# EAGLE design Balancer (EAGLE 7.6.0)

## Sheet 1 of 2
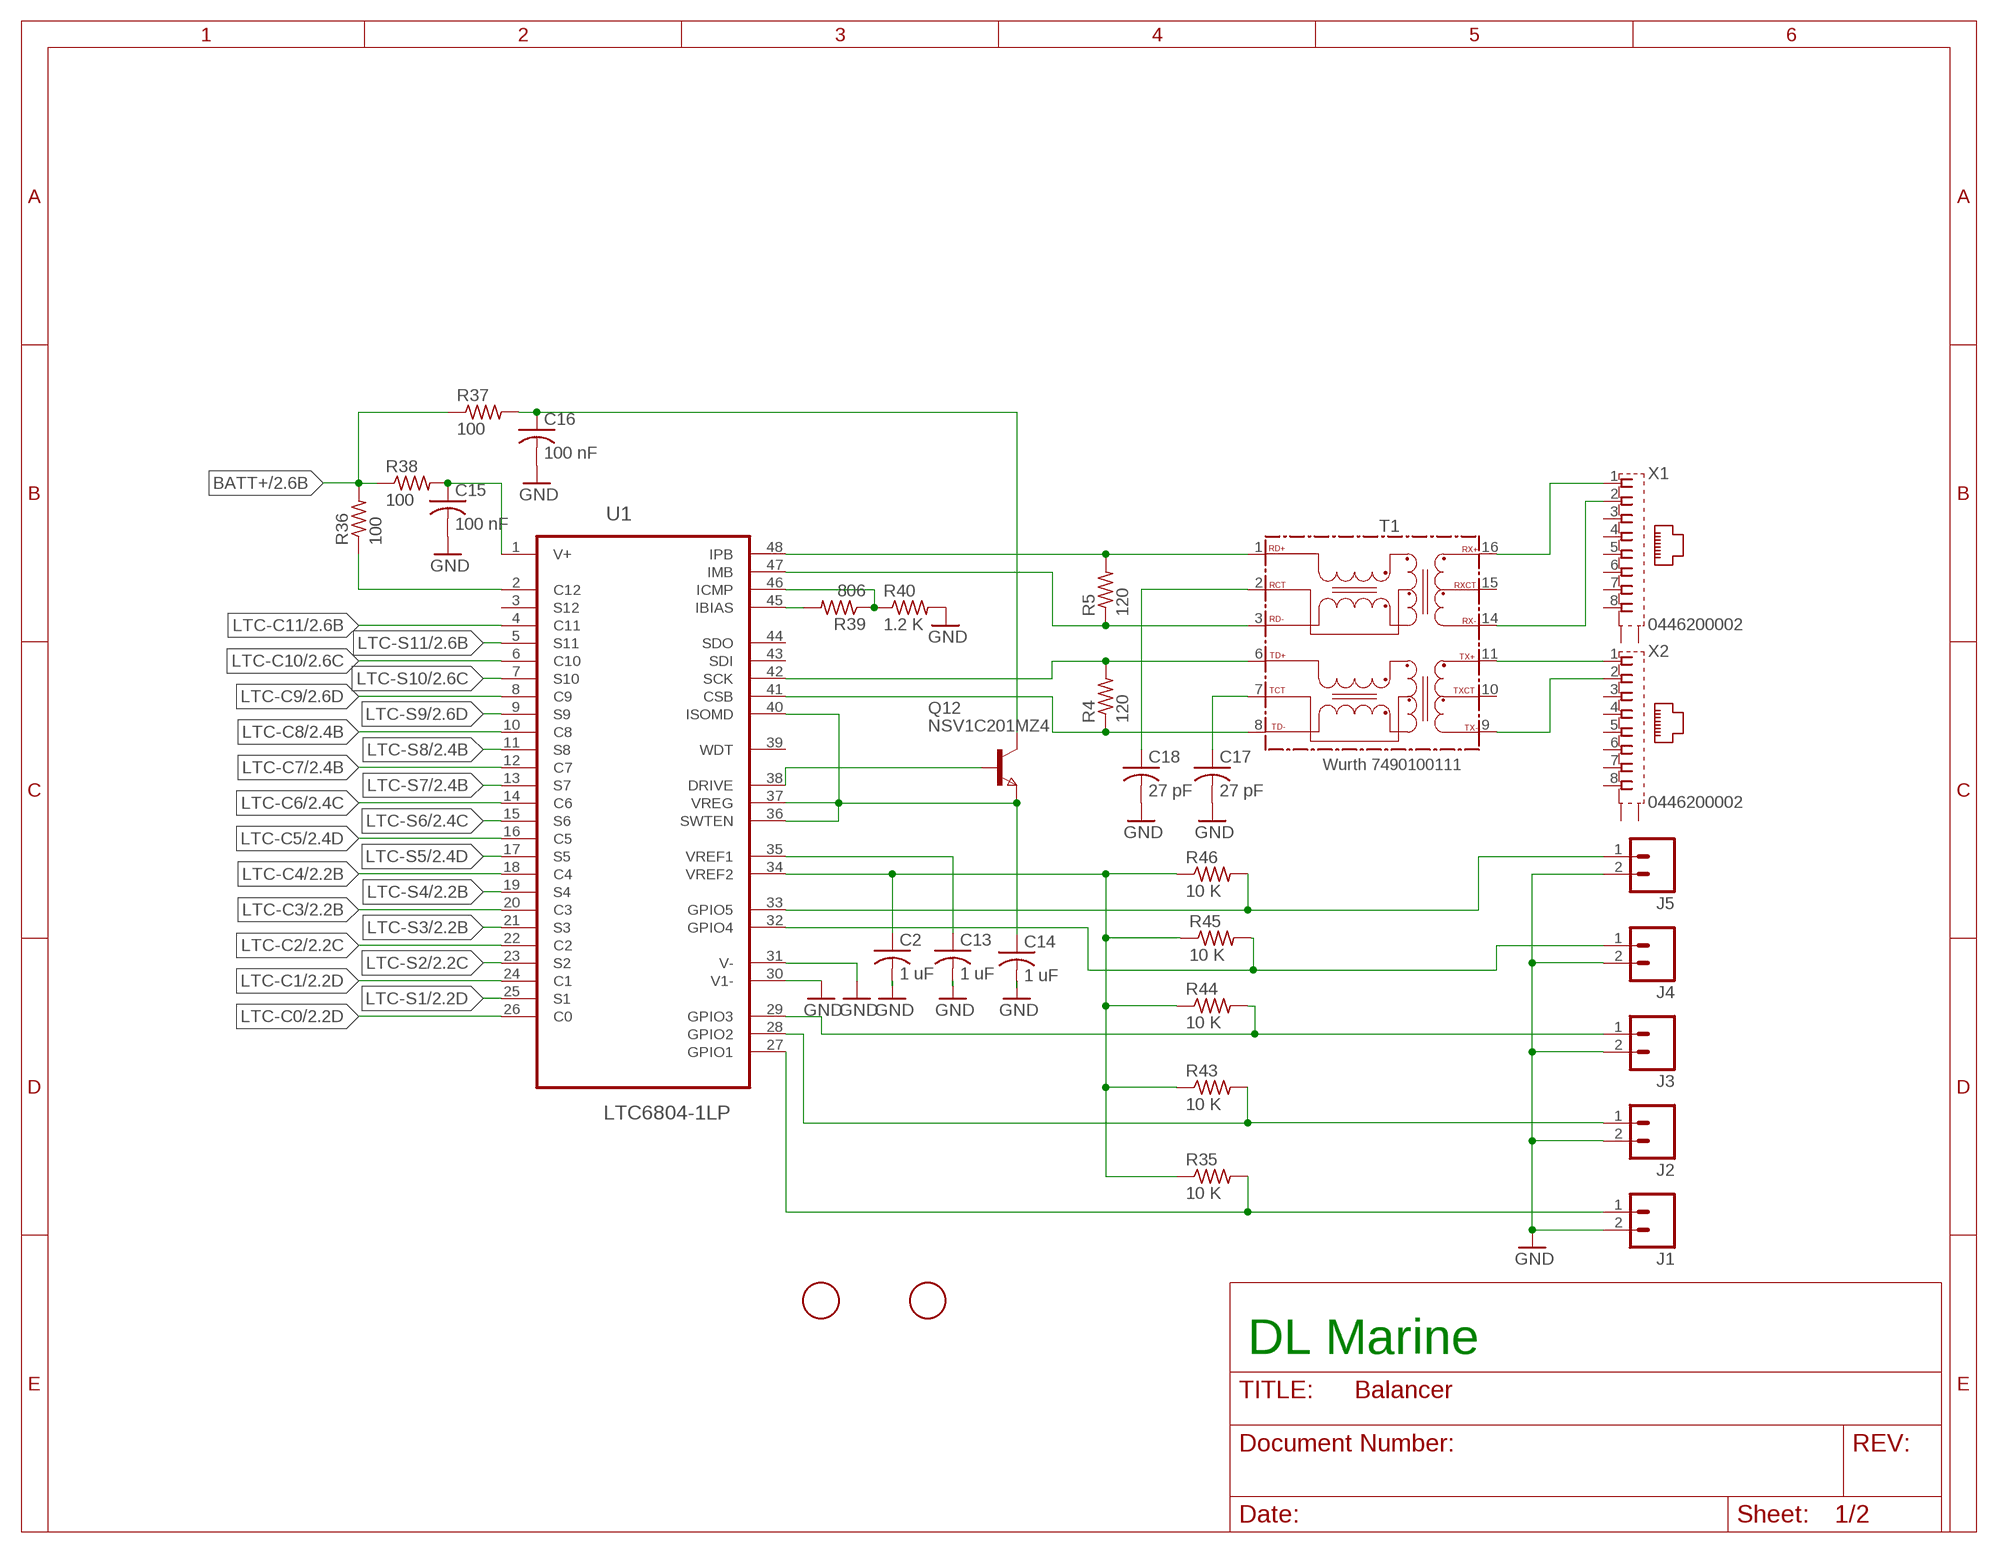
[diagram p0: schematic, sheet 1]

### Parts
C2  1 uF  C-USC0805  [C0805]
C13  1 uF  C-USC0805  [C0805]
C14  1 uF  C-USC0805  [C0805]
C15  100 nF  C-USC0805  [C0805]
C16  100 nF  C-USC0805  [C0805]
C17  27 pF  C-USC0805  [C0805]
C18  27 pF  C-USC0805  [C0805]
J1  M02PTH  [1X02]
J2  M02PTH  [1X02]
J3  M02PTH  [1X02]
J4  M02PTH  [1X02]
J5  M02PTH  [1X02]
Q12  NSV1C201MZ4  NPNSOT223  [SOT223]
R4  120  R-US_R0805  [R0805]
R5  120  R-US_R0805  [R0805]
R35  10 K  R-US_R0805  [R0805]
R36  100  R-US_R0805  [R0805]
R37  100  R-US_R0805  [R0805]
R38  100  R-US_R0805  [R0805]
R39  806  R-US_R0805  [R0805]
R40  1.2 K  R-US_R0805  [R0805]
R43  10 K  R-US_R0805  [R0805]
R44  10 K  R-US_R0805  [R0805]
R45  10 K  R-US_R0805  [R0805]
R46  10 K  R-US_R0805  [R0805]
T1  Wurth 7490100111  WE-LAN-10/100-BASE-T,749010011"  [749010011]
U1  LTC6804-1LP  [SOP50P810X110-48N]
U$1  FIDUCIAL  [FIDUCIAL_1MM]
U$2  FIDUCIAL  [FIDUCIAL_1MM]
X1  0446200002  [0446200002]
X2  0446200002  [0446200002]

### Nets
BATT+: R36.2 R37.1 R38.1 ; also sheet 2
GND: C2.2 C13.2 C14.2 C15.2 C16.2 C17.2 C18.2 J1.2 J2.2 J3.2 J4.2 J5.2 R40.2 U1.30(V1-) U1.31(V-) ; also sheet 2
LTC-C0: U1.26(C0) ; also sheet 2
LTC-C1: U1.24(C1) ; also sheet 2
LTC-C2: U1.22(C2) ; also sheet 2
LTC-C3: U1.20(C3) ; also sheet 2
LTC-C4: U1.18(C4) ; also sheet 2
LTC-C5: U1.16(C5) ; also sheet 2
LTC-C6: U1.14(C6) ; also sheet 2
LTC-C7: U1.12(C7) ; also sheet 2
LTC-C8: U1.10(C8) ; also sheet 2
LTC-C9: U1.8(C9) ; also sheet 2
LTC-C10: U1.6(C10) ; also sheet 2
LTC-C11: U1.4(C11) ; also sheet 2
LTC-S1: U1.25(S1) ; also sheet 2
LTC-S2: U1.23(S2) ; also sheet 2
LTC-S3: U1.21(S3) ; also sheet 2
LTC-S4: U1.19(S4) ; also sheet 2
LTC-S5: U1.17(S5) ; also sheet 2
LTC-S6: U1.15(S6) ; also sheet 2
LTC-S7: U1.13(S7) ; also sheet 2
LTC-S8: U1.11(S8) ; also sheet 2
LTC-S9: U1.9(S9) ; also sheet 2
LTC-S10: U1.7(S10) ; also sheet 2
LTC-S11: U1.5(S11) ; also sheet 2
N$32: C16.1 Q12.2(C) Q12.4(C) R37.2
N$34: R5.2 T1.1(RD+) U1.48(IPB)
N$35: R5.1 T1.3(RD-) U1.47(IMB)
N$36: C14.1 Q12.3(E) U1.36(SWTEN) U1.37(VREG) U1.40(ISOMD)
N$37: C13.1 U1.35(VREF1)
N$38: C2.1 R35.1 R43.1 R44.1 R45.1 R46.1 U1.34(VREF2)
N$39: R4.2 T1.6(TD+) U1.42(SCK)
N$40: R4.1 T1.8(TD-) U1.41(CSB)
N$41: R39.2 U1.45(IBIAS)
N$42: R39.1 R40.1 U1.46(ICMP)
N$43: C15.1 R38.2 U1.1(V+)
N$44: C18.1 T1.2(RCT)
N$45: C17.1 T1.7(TCT)
N$46: R36.1 U1.2(C12)
N$47: Q12.1(B) U1.38(DRIVE)
N$48: T1.16(RX+) X1.1
N$49: T1.14(RX-) X1.2
N$50: T1.11(TX+) X2.1
N$51: T1.9(TX-) X2.2
N$52: J2.1 R43.2 U1.28(GPIO2)
N$54: J1.1 R35.2 U1.27(GPIO1)
N$56: J3.1 R44.2 U1.29(GPIO3)
N$57: J4.1 R45.2 U1.32(GPIO4)
N$58: J5.1 R46.2 U1.33(GPIO5)
Unconnected: T1.10(TXCT) T1.15(RXCT) U1.3(S12) U1.39(WDT) U1.43(SDI) U1.44(SDO) X1.3 X1.4 X1.5 X1.6 X1.7 X1.8 X1.S@1(S1) X1.S@2(S2) X2.3 X2.4 X2.5 X2.6 X2.7 X2.8 X2.S@1(S1) X2.S@2(S2)

### Notes on the sheet
- DL Marine

## Sheet 2 of 2
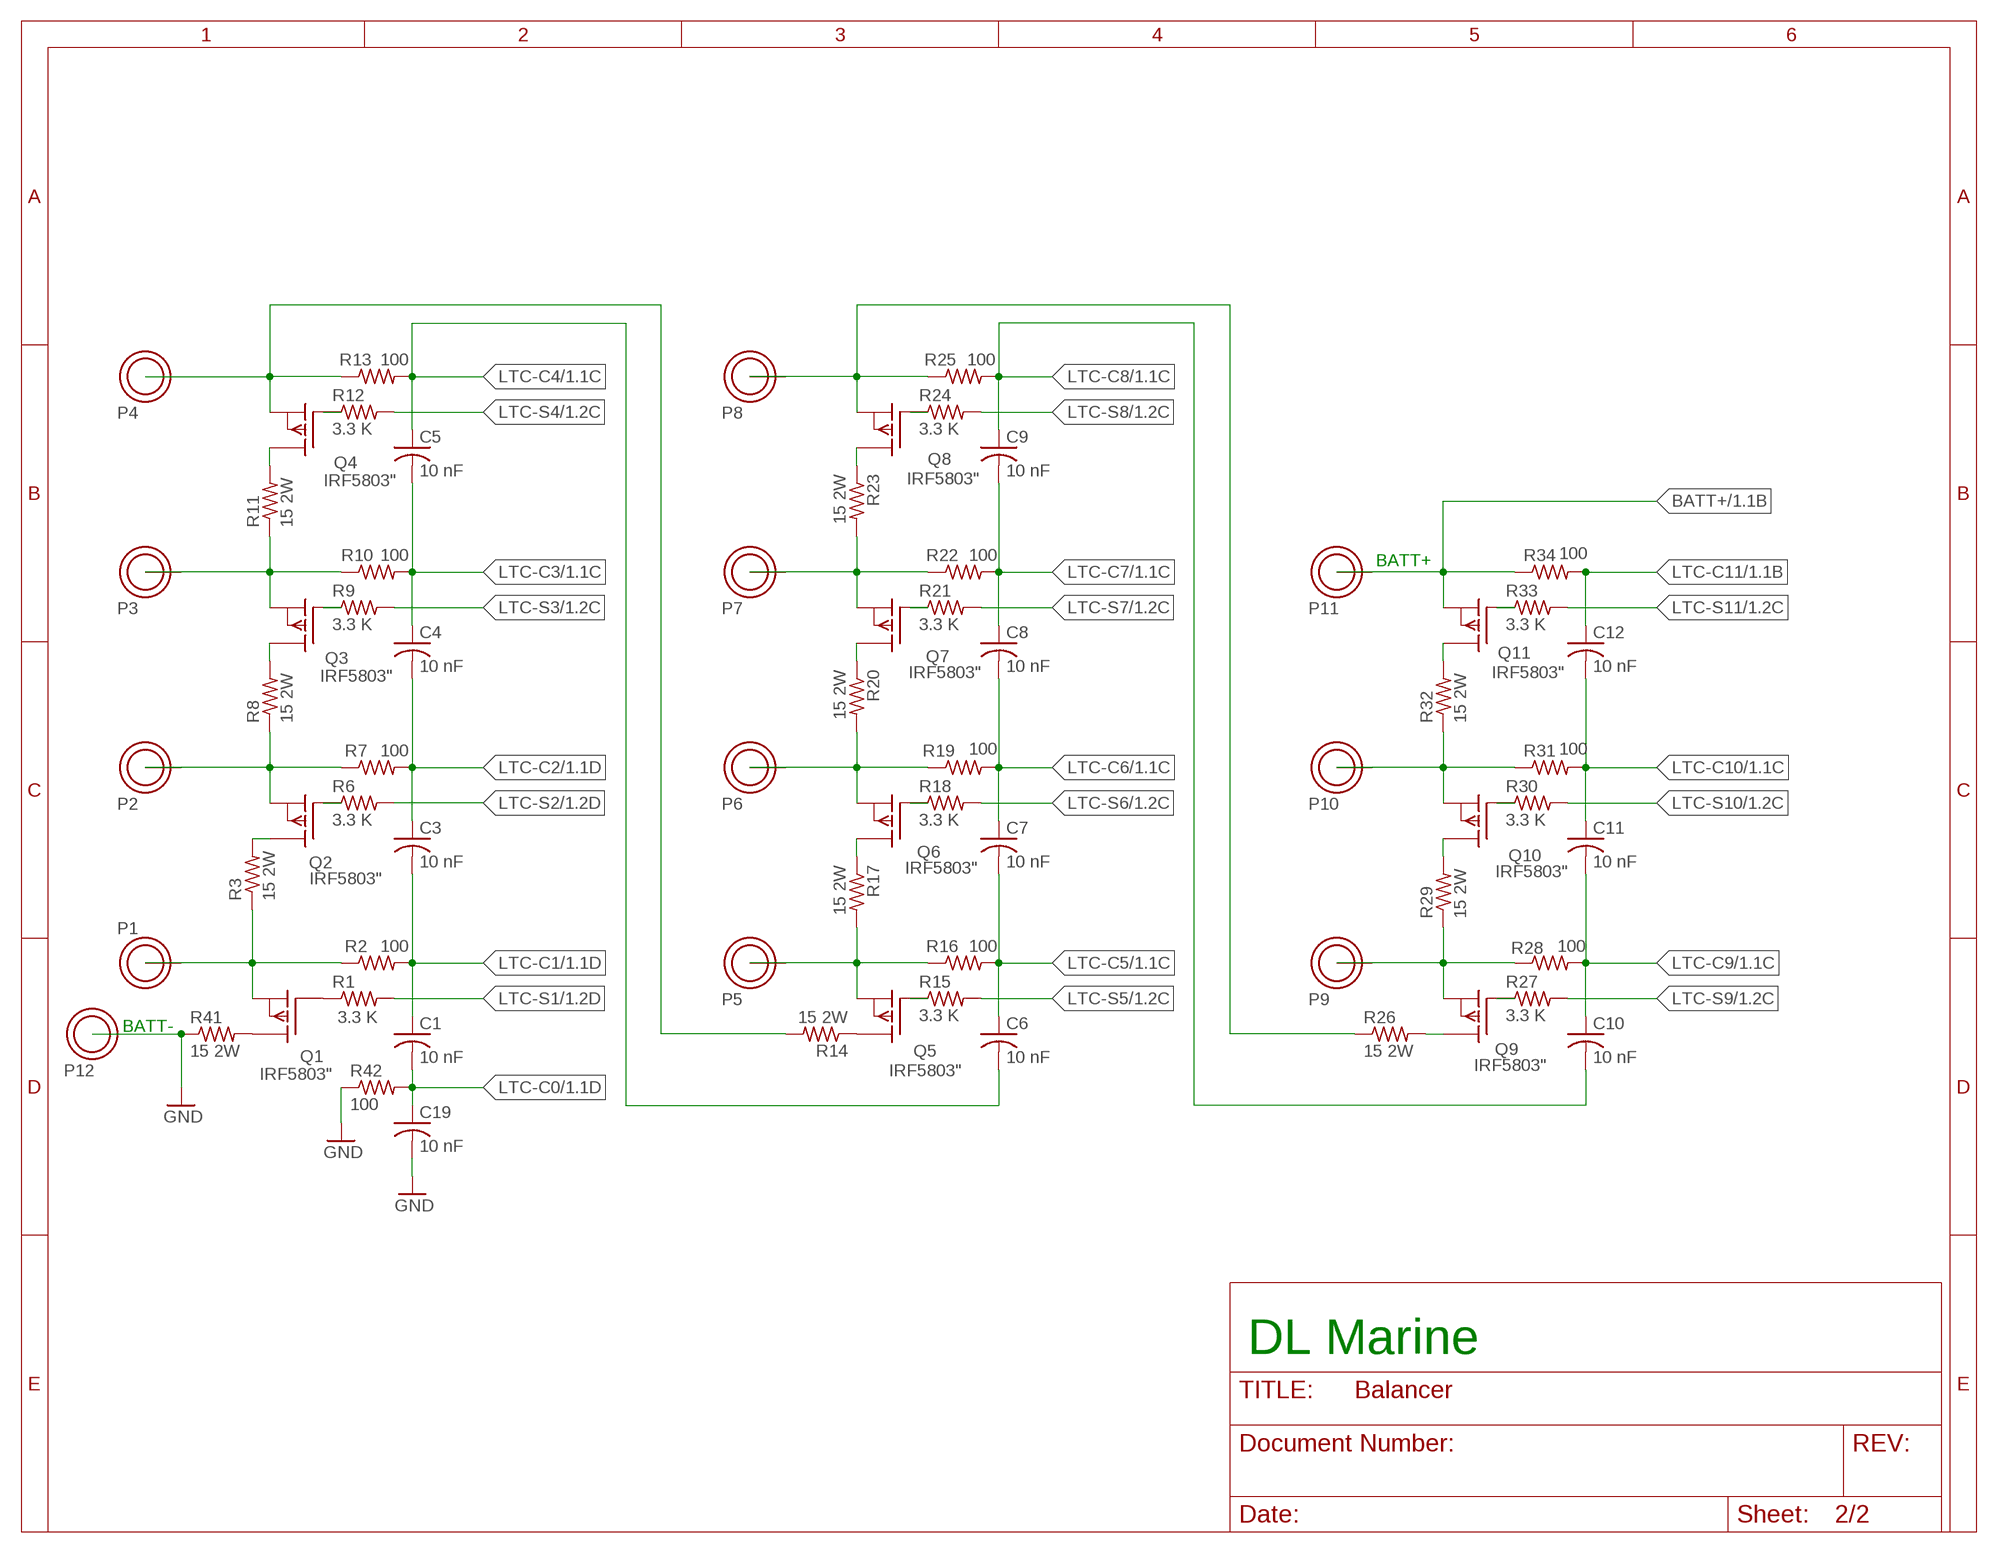
[diagram p1: schematic, sheet 2]

### Parts
C1  10 nF  C-USC0805  [C0805]
C3  10 nF  C-USC0805  [C0805]
C4  10 nF  C-USC0805  [C0805]
C5  10 nF  C-USC0805  [C0805]
C6  10 nF  C-USC0805  [C0805]
C7  10 nF  C-USC0805  [C0805]
C8  10 nF  C-USC0805  [C0805]
C9  10 nF  C-USC0805  [C0805]
C10  10 nF  C-USC0805  [C0805]
C11  10 nF  C-USC0805  [C0805]
C12  10 nF  C-USC0805  [C0805]
C19  10 nF  C-USC0805  [C0805]
P1  CONN-CELL  [CONN-CELL]
P2  CONN-CELL  [CONN-CELL]
P3  CONN-CELL  [CONN-CELL]
P4  CONN-CELL  [CONN-CELL]
P5  CONN-CELL  [CONN-CELL]
P6  CONN-CELL  [CONN-CELL]
P7  CONN-CELL  [CONN-CELL]
P8  CONN-CELL  [CONN-CELL]
P9  CONN-CELL  [CONN-CELL]
P10  CONN-CELL  [CONN-CELL]
P11  CONN-CELL  [CONN-CELL]
P12  CONN-CELL  [CONN-CELL]
Q1  IRF5803"  [TSOP6_SOT457]
Q2  IRF5803"  [TSOP6_SOT457]
Q3  IRF5803"  [TSOP6_SOT457]
Q4  IRF5803"  [TSOP6_SOT457]
Q5  IRF5803"  [TSOP6_SOT457]
Q6  IRF5803"  [TSOP6_SOT457]
Q7  IRF5803"  [TSOP6_SOT457]
Q8  IRF5803"  [TSOP6_SOT457]
Q9  IRF5803"  [TSOP6_SOT457]
Q10  IRF5803"  [TSOP6_SOT457]
Q11  IRF5803"  [TSOP6_SOT457]
R1  3.3 K  R-US_R0805  [R0805]
R2  100  R-US_R0805  [R0805]
R3  15 2W  R-US_R2512  [R2512L]
R6  3.3 K  R-US_R0805  [R0805]
R7  100  R-US_R0805  [R0805]
R8  15 2W  R-US_R2512  [R2512L]
R9  3.3 K  R-US_R0805  [R0805]
R10  100  R-US_R0805  [R0805]
R11  15 2W  R-US_R2512  [R2512L]
R12  3.3 K  R-US_R0805  [R0805]
R13  100  R-US_R0805  [R0805]
R14  15 2W  R-US_R2512  [R2512L]
R15  3.3 K  R-US_R0805  [R0805]
R16  100  R-US_R0805  [R0805]
R17  15 2W  R-US_R2512  [R2512L]
R18  3.3 K  R-US_R0805  [R0805]
R19  100  R-US_R0805  [R0805]
R20  15 2W  R-US_R2512  [R2512L]
R21  3.3 K  R-US_R0805  [R0805]
R22  100  R-US_R0805  [R0805]
R23  15 2W  R-US_R2512  [R2512L]
R24  3.3 K  R-US_R0805  [R0805]
R25  100  R-US_R0805  [R0805]
R26  15 2W  R-US_R2512  [R2512L]
R27  3.3 K  R-US_R0805  [R0805]
R28  100  R-US_R0805  [R0805]
R29  15 2W  R-US_R2512  [R2512L]
R30  3.3 K  R-US_R0805  [R0805]
R31  100  R-US_R0805  [R0805]
R32  15 2W  R-US_R2512  [R2512L]
R33  3.3 K  R-US_R0805  [R0805]
R34  100  R-US_R0805  [R0805]
R41  15 2W  R-US_R2512  [R2512L]
R42  100  R-US_R0805  [R0805]

### Nets
BATT+: P11.P$1 Q11.P$4(S) R34.1 ; also sheet 1
GND: C19.2 P12.P$1 R41.1 R42.1 ; also sheet 1
LTC-C0: C1.2 C19.1 R42.2 ; also sheet 1
LTC-C1: C1.1 C3.2 R2.2 ; also sheet 1
LTC-C2: C3.1 C4.2 R7.2 ; also sheet 1
LTC-C3: C4.1 C5.2 R10.2 ; also sheet 1
LTC-C4: C5.1 C6.2 R13.2 ; also sheet 1
LTC-C5: C6.1 C7.2 R16.2 ; also sheet 1
LTC-C6: C7.1 C8.2 R19.2 ; also sheet 1
LTC-C7: C8.1 C9.2 R22.2 ; also sheet 1
LTC-C8: C9.1 C10.2 R25.2 ; also sheet 1
LTC-C9: C10.1 C11.2 R28.2 ; also sheet 1
LTC-C10: C11.1 C12.2 R31.2 ; also sheet 1
LTC-C11: C12.1 R34.2 ; also sheet 1
LTC-S1: R1.2 ; also sheet 1
LTC-S2: R6.2 ; also sheet 1
LTC-S3: R9.2 ; also sheet 1
LTC-S4: R12.2 ; also sheet 1
LTC-S5: R15.2 ; also sheet 1
LTC-S6: R18.2 ; also sheet 1
LTC-S7: R21.2 ; also sheet 1
LTC-S8: R24.2 ; also sheet 1
LTC-S9: R27.2 ; also sheet 1
LTC-S10: R30.2 ; also sheet 1
LTC-S11: R33.2 ; also sheet 1
N$1: Q2.P$3(G) R6.1
N$2: Q1.P$3(G) R1.1
N$3: P2.P$1 Q2.P$4(S) R7.1 R8.1
N$4: P1.P$1 Q1.P$4(S) R2.1 R3.1
N$5: Q1.P$1(D) Q1.P$2(D) Q1.P$5(D) Q1.P$6(D) R41.2
N$6: Q2.P$1(D) Q2.P$2(D) Q2.P$5(D) Q2.P$6(D) R3.2
N$7: Q3.P$3(G) R9.1
N$8: P3.P$1 Q3.P$4(S) R10.1 R11.1
N$9: Q3.P$1(D) Q3.P$2(D) Q3.P$5(D) Q3.P$6(D) R8.2
N$10: Q4.P$3(G) R12.1
N$11: P4.P$1 Q4.P$4(S) R13.1 R14.2
N$12: Q4.P$1(D) Q4.P$2(D) Q4.P$5(D) Q4.P$6(D) R11.2
N$13: Q5.P$3(G) R15.1
N$14: P5.P$1 Q5.P$4(S) R16.1 R17.2
N$15: Q5.P$1(D) Q5.P$2(D) Q5.P$5(D) Q5.P$6(D) R14.1
N$16: Q6.P$3(G) R18.1
N$17: P6.P$1 Q6.P$4(S) R19.1 R20.2
N$18: Q6.P$1(D) Q6.P$2(D) Q6.P$5(D) Q6.P$6(D) R17.1
N$19: Q7.P$3(G) R21.1
N$20: P7.P$1 Q7.P$4(S) R22.1 R23.2
N$21: Q7.P$1(D) Q7.P$2(D) Q7.P$5(D) Q7.P$6(D) R20.1
N$22: Q8.P$3(G) R24.1
N$23: P8.P$1 Q8.P$4(S) R25.1 R26.1
N$24: Q8.P$1(D) Q8.P$2(D) Q8.P$5(D) Q8.P$6(D) R23.1
N$25: Q9.P$3(G) R27.1
N$26: P9.P$1 Q9.P$4(S) R28.1 R29.1
N$27: Q9.P$1(D) Q9.P$2(D) Q9.P$5(D) Q9.P$6(D) R26.2
N$28: Q10.P$3(G) R30.1
N$29: P10.P$1 Q10.P$4(S) R31.1 R32.1
N$30: Q10.P$1(D) Q10.P$2(D) Q10.P$5(D) Q10.P$6(D) R29.2
N$31: Q11.P$3(G) R33.1
N$33: Q11.P$1(D) Q11.P$2(D) Q11.P$5(D) Q11.P$6(D) R32.2

### Notes on the sheet
- BATT+
- BATT-
- DL Marine

## Library data of the parts
C1-C19 = resistor:C-US: CAPACITOR, American symbol
J1-J5 = SparkFun-Connectors:M02: Standard 2-pin 0.1" header. Use with - straight break away headers ( PRT-00116) - right angle break away headers (PRT-00553) - swiss pins (PRT-00743) - machine pins (PRT-00117) - female headers (PRT-00115) Molex polarized connector foot print use with: PRT-08233 with associated crimp pins and housings. 2.54_SCREWTERM for use with PRT-10571. 3.5mm Screw Terminal footprints for PRT-08084 5mm Screw Terminal footprints for use with PRT-08432
P1-P12 = BMS:CONN-CELL: 2.2 MM DRILL PAD FOR BATTERY CONNECTOR PIN
Q1-Q11 = BMS1:IRF5803: P-Channel Enhancement MOSFET
Q12 = zetex:NPNSOT223: NPN TRANSISTOR; MPN: DJT4031N-13; OC_FARNELL: 1710672; OC_NEWARK: 25R4490
R1 R2 R4-R7 R9 R10 R12 R13 R15 R16 R18 R19 R21 R22 R24 R25 R27 R28 R30 R31 R33-R40 R42-R46 = resistor:R-US_: RESISTOR, American symbol
R3 R8 R11 R14 R17 R20 R23 R26 R29 R32 R41 = BMS1:R-US_: RESISTOR, American symbol
T1 = WE-LAN-10_100-BASE-T,749010011:WE-LAN-10/100-BASE-T,749010011: LAN-Transformer WE-LAN 10/100 Base T - Compliant with IEEE 802.3 standards - SMD -- Ethernet -- Power over Ethernet -- 1 Gigabit Ethernet -- Compliant with most IC's for ethernet applications like Intel, AMD, Globespan and Realtek -- Hub, Router, Switch; MPN: 749010011; OC_FARNELL: 1636344; OC_NEWARK: unknown; PACKAGE: 10/100/Base-T; SUPPLIER: Wuerth Elektronik
U1 = LTC_By_element14_Batch_1:LTC6804-1LP: Multicell Battery Stack Monitor
U$1 U$2 = adafruit:FIDUCIAL: For use by pick and place machines to calibrate the vision/machine, 1mm By microbuilder.eu
X1 X2 = con-molex:0446200002: RJ-45 INVERTED MODULAR JACK ASSEMBLY WITH RJ-11 KEEPOUT FEATURE Source: Data sheet <http://www.farnell.com/datasheets/73207.pdf> MOLEX 0446200002 BUCHSE, RJ45, GESCHIRMT Source: Farnell <http://de.farnell.com/molex/0446200002/buchse-rj45-geschirmt/dp/9251910?ost=9251910>; MF: MOLEX; MPN: 0446200002; OC_FARNELL: 9251910

## Board
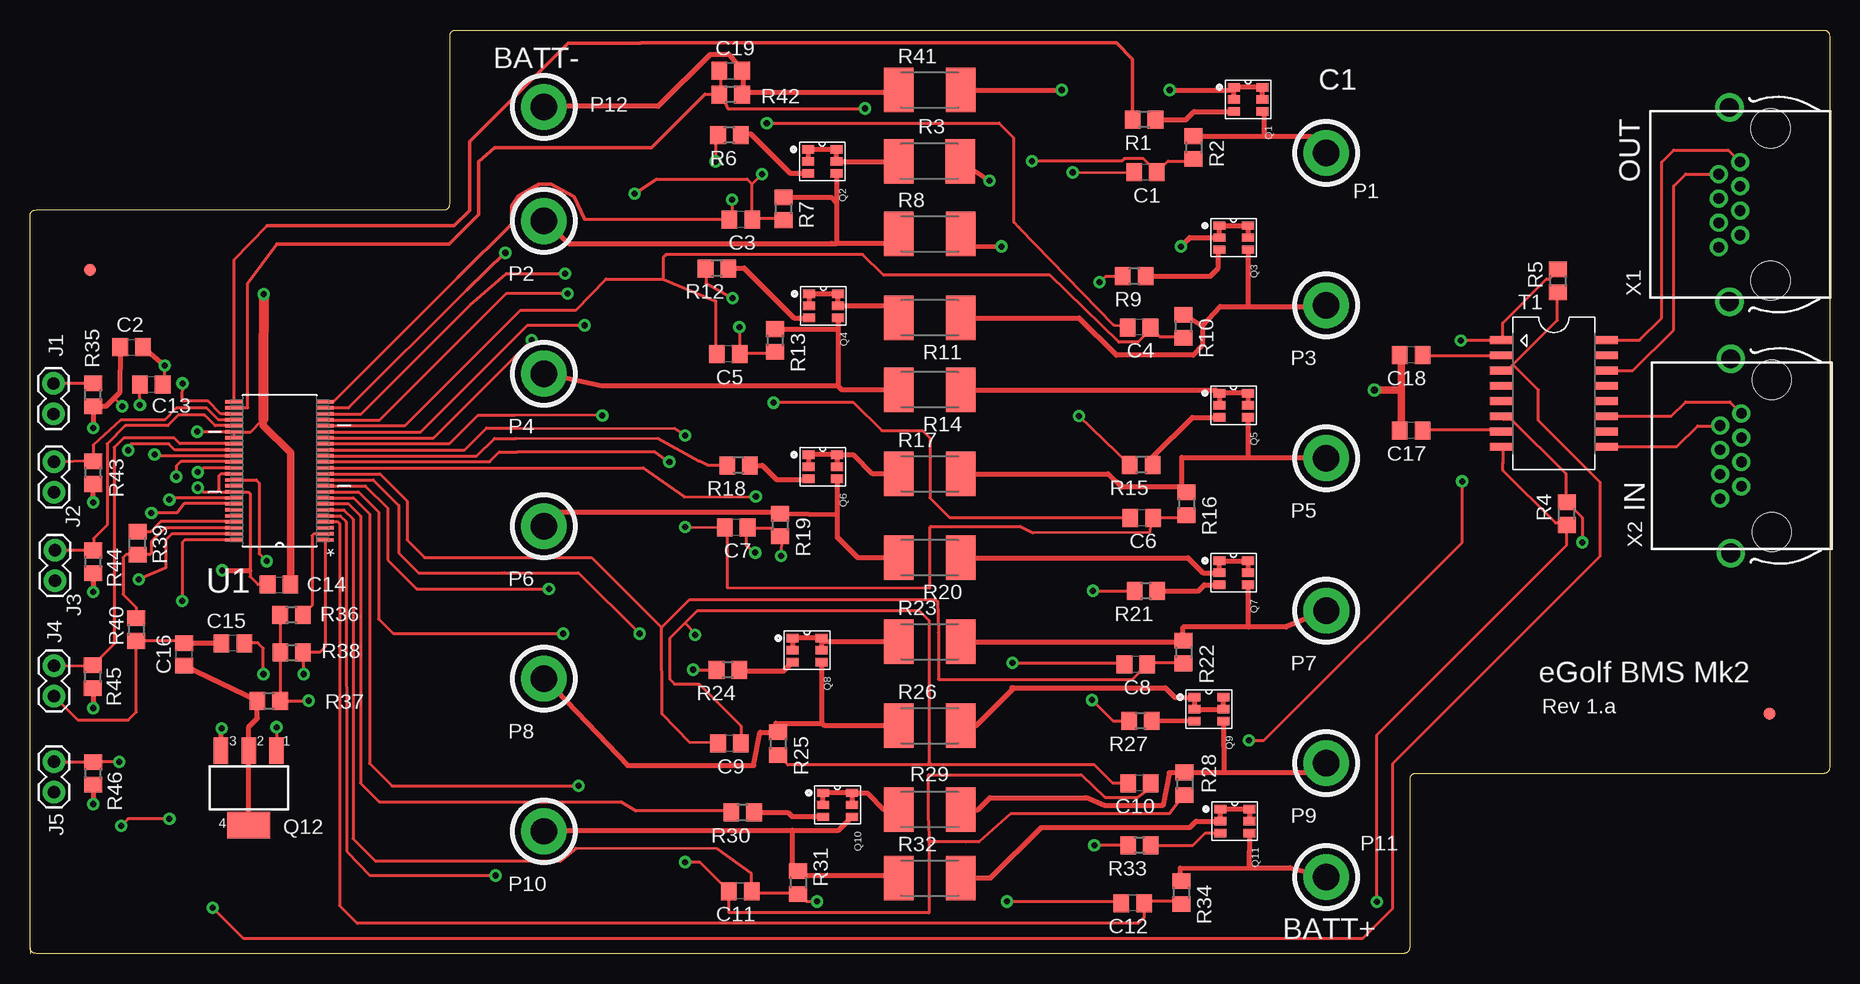
[diagram p2: board, top side]
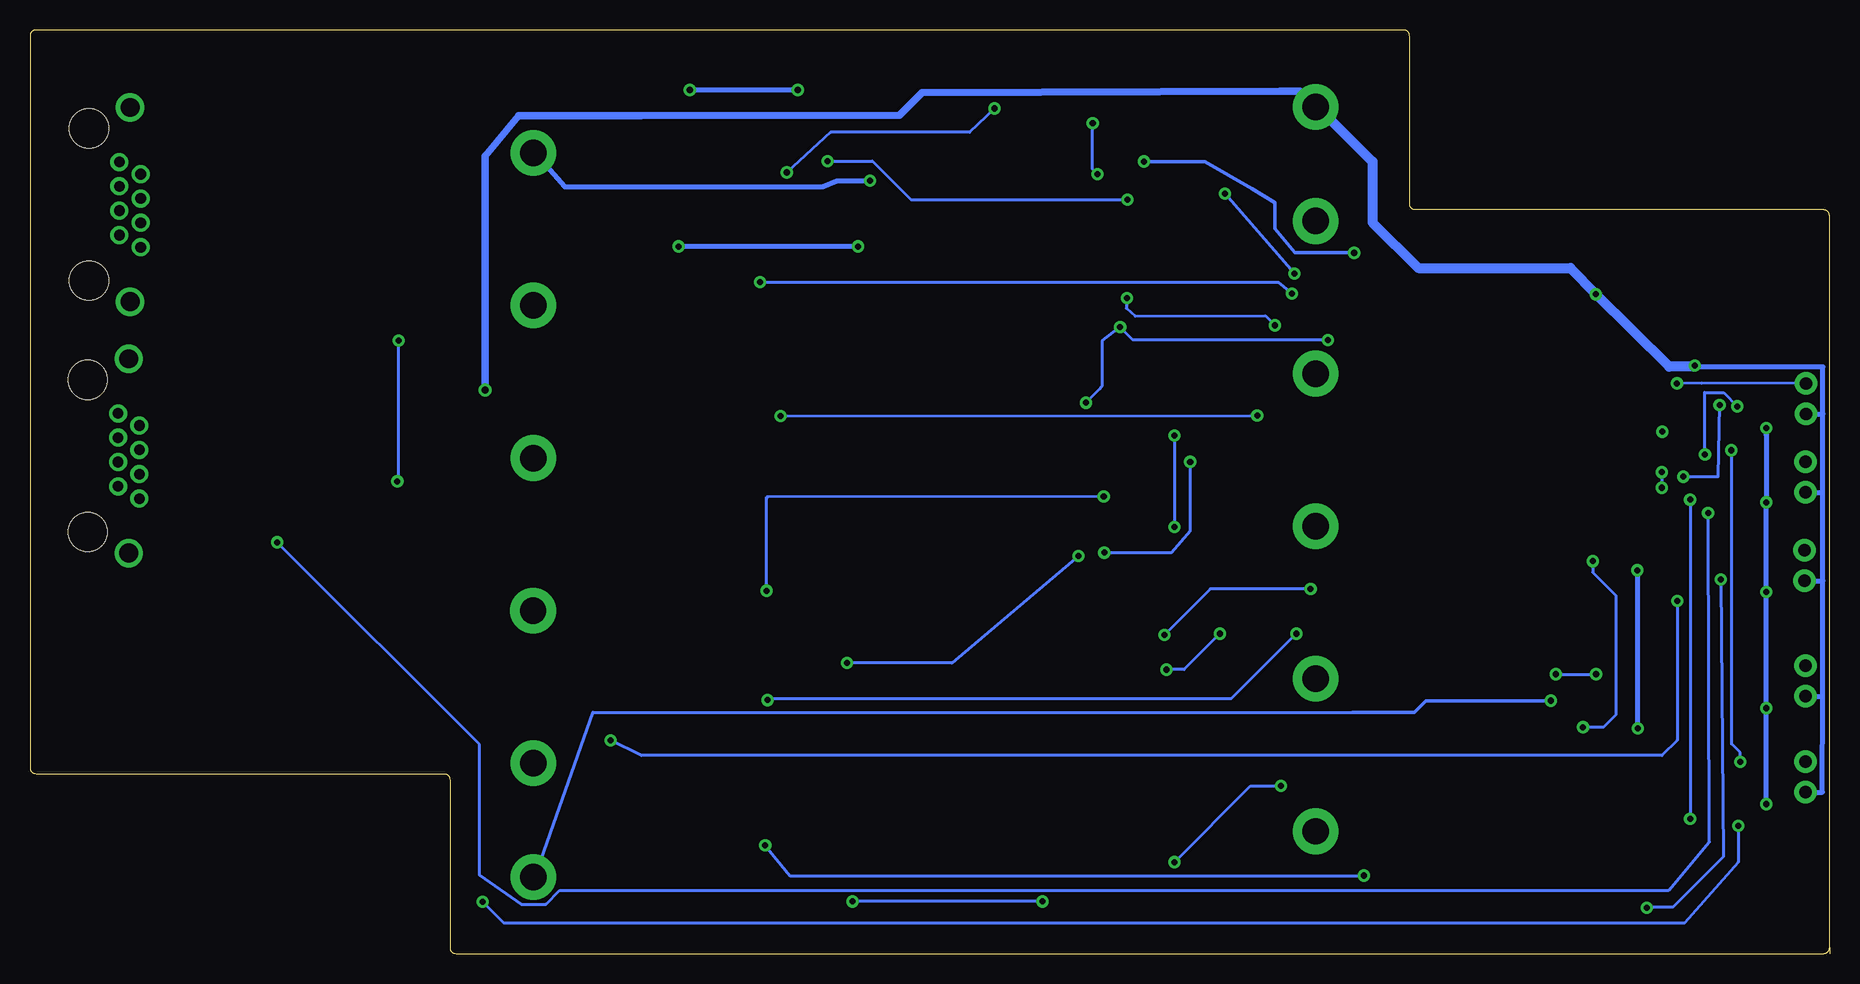
[diagram p3: board, bottom side, seen from below]

Size 150 x 77 mm. Coordinates in mm from the lower left corner, seen from the top.
Outline: 0,0.5 0,0
Outline: 0,61.5 arc-90 0.5,62
Outline: 34.5,62 arc90 35,62.5
Outline: 35,76.5 arc-90 35.5,77
Outline: 149.5,77 arc-90 150,76.5
Outline: 150,15.5 arc-90 149.5,15
Outline: 115.5,15 arc90 115,14.5
Outline: 115,0.5 arc-90 114.5,0
Outline: 0.5,0 arc-90 0,0.5
Outline: 0,61.5 arc-90 0.5,62
Outline: 0.5,62 34.5,62
Outline: 34.5,62 arc90 35,62.5
Outline: 35,62.5 35,76.5
Outline: 35,76.5 arc-90 35.5,77
Outline: 35.5,77 149.5,77
Outline: 149.5,77 arc-90 150,76.5
Outline: 150,76.5 150,15.5
Outline: 150,15.5 arc-90 149.5,15
Outline: 149.5,15 115.5,15
Outline: 115.5,15 arc90 115,14.5
Outline: 115,14.5 115,0.5
Outline: 115,0.5 arc-90 114.5,0
Outline: 114.5,0 0.5,0
Outline: 0.5,0 arc-90 0,0.5
Outline: 0,0.5 0,61.5
Copper layers (1*16): Top 0.035mm / dielectric 1.5mm / Bottom 0.035mm
Design rules "SparkFun": minimum track width 8mil, minimum drill 20mil, track to track 8mil, track to pad 8mil, pad to pad 8mil, via to via 8mil, smd to smd 8mil, copper to edge 8mil, drill to drill 8mil, minimum pad ring 12mil, minimum via ring 10mil, stop-mask expansion 4mil, vias tented up to drill 20mil, thermal gap 10mil

### Footprints (pad centres in the part's own frame; a part is rotated, then mirrored left to right if it is on the bottom)
C0805 = smd 1.3 x 1.5: 1 -0.95,0; 2 0.95,0
1X02 = drill 1.016 pad 1.88: 1 0,0; 2 2.54,0
CONN-CELL = drill 2.2 pad 3.81: P$1 0,0
TSOP6_SOT457 = smd 0.7 x 1: P$1 -1,-1.2; P$2 0,-1.2; P$3 1,-1.2; P$4 1,1.2; P$5 0,1.2; P$6 -1,1.2
SOT223 = smd 1.219 x 2.235: 1 -2.311,-3.099; 2 0,-3.099; 3 2.311,-3.099 | smd 3.6 x 2.2: 4 0,3.099
R0805 = smd 1.3 x 1.5: 1 -0.95,0; 2 0.95,0
R2512L = smd 2.45 x 3.7: 1 -2.575,0; 2 2.575,0
749010011 = smd 0.64 x 1.91: 1 -4.445,-4.385; 2 -3.175,-4.385; 3 -1.905,-4.385; 4 -0.635,-4.385; 5 0.635,-4.385; 6 1.905,-4.385; 7 3.175,-4.385; 8 4.445,-4.385; 9 4.445,4.385; 10 3.175,4.385; 11 1.905,4.385; 12 0.635,4.385; 13 -0.635,4.385; 14 -1.905,4.385; 15 -3.175,4.385; 16 -4.445,4.385
SOP50P810X110-48N = smd 1.473 x 0.279: 1 -3.785,5.766; 2 -3.785,5.258; 3 -3.785,4.75; 4 -3.785,4.242; 5 -3.785,3.759; 6 -3.785,3.251; 7 -3.785,2.743; 8 -3.785,2.261; 9 -3.785,1.753; 10 -3.785,1.245; 11 -3.785,0.762; 12 -3.785,0.254; 13 -3.785,-0.254; 14 -3.785,-0.762; 15 -3.785,-1.245; 16 -3.785,-1.753; 17 -3.785,-2.261; 18 -3.785,-2.743; 19 -3.785,-3.251; 20 -3.785,-3.759; 21 -3.785,-4.242; 22 -3.785,-4.75; 23 -3.785,-5.258; 24 -3.785,-5.766; 25 3.785,-5.766; 26 3.785,-5.258; 27 3.785,-4.75; 28 3.785,-4.242; 29 3.785,-3.759; 30 3.785,-3.251; 31 3.785,-2.743; 32 3.785,-2.261; 33 3.785,-1.753; 34 3.785,-1.245; 35 3.785,-0.762; 36 3.785,-0.254; 37 3.785,0.254; 38 3.785,0.762; 39 3.785,1.245; 40 3.785,1.753; 41 3.785,2.261; 42 3.785,2.743; 43 3.785,3.251; 44 3.785,3.759; 45 3.785,4.242; 46 3.785,4.75; 47 3.785,5.258; 48 3.785,5.766
FIDUCIAL_1MM = smd 1 x 1: 1 0,0
0446200002 = drill 0.889 pad 1.422: 1 3.556,2.54; 2 2.54,4.318; 3 1.524,2.54; 4 0.508,4.318; 5 -0.508,2.54; 6 -1.524,4.318; 7 -2.54,2.54; 8 -3.556,4.318 | drill 1.575 pad 2.286: S@1 -8.103,3.429; S@2 8.103,3.429 | hole 3.251: 6.35,0; -6.35,0

### Placement (x,y rotation side)
C1  92.98,65.13 180 top
C2  8.47,50.55 0 top
C3  59.24,61.2 180 top
C4  92.44,52.2 180 top
C5  58.2,49.97 180 top
C6  92.67,36.32 180 top
C7  58.86,35.52 180 top
C8  92.18,24.12 180 top
C9  58.3,17.52 180 top
C10  92.48,14.21 180 top
C11  59.2,5.21 180 top
C12  91.92,4.21 180 top
C13  10.11,47.46 0 top
C14  20.76,30.76 0 top
C15  16.92,25.87 180 top
C16  12.85,24.94 90 top
C17  115.12,43.61 180 top
C18  115.12,49.89 180 top
C19  58.4,73.6 0 top
J1  1.96,47.53 270 top
J2  2,41 270 top
J3  2.08,33.62 270 top
J4  2,24 270 top
J5  2,16 270 top
P1  108.05,66.76 0 top
P2  42.84,61.07 0 top
P3  108.04,54.04 0 top
P4  42.84,48.35 0 top
P5  108.05,41.31 0 top
P6  42.83,35.63 0 top
P7  108.06,28.59 0 top
P8  42.83,22.91 0 top
P9  108.05,15.88 0 top
P10  42.83,10.19 0 top
P11  108.05,6.38 0 top
P12  42.84,70.58 0 top
Q1  101.55,71.22 270 top
Q2  66.04,66.04 270 top
Q3  100.33,59.69 270 top
Q4  66.14,54 270 top
Q5  100.33,45.72 270 top
Q6  66.09,40.59 270 top
Q7  100.33,31.75 270 top
Q8  64.77,25.3 270 top
Q9  98.27,20.37 270 top
Q10  67.31,12.4 270 top
Q11  100.43,11.05 270 top
Q12  18.24,13.82 180 top
R1  92.87,69.52 180 top
R2  97,67.2 270 top
R3  74.98,66.04 180 top
R4  128.09,36.68 90 top
R5  127.37,56.08 90 top
R6  58.3,68.24 180 top
R7  62.8,62.1 270 top
R8  75,60 0 top
R9  92.04,56.47 180 top
R10  96.13,52.3 270 top
R11  75,53 180 top
R12  57.26,57.13 180 top
R13  62.1,51.12 270 top
R14  75,47 180 top
R15  92.62,40.75 180 top
R16  96.39,37.51 270 top
R17  75,40 0 top
R18  59.06,40.7 180 top
R19  62.53,35.73 270 top
R20  75,33 180 top
R21  93.02,30.24 180 top
R22  96.16,25.14 270 top
R23  75,26 0 top
R24  58.18,23.64 180 top
R25  62.36,17.5 270 top
R26  75,19 0 top
R27  92.56,19.4 180 top
R28  96.24,14.16 270 top
R29  75,12 180 top
R30  59.4,11.76 180 top
R31  64.04,5.92 270 top
R32  75,6.3 0 top
R33  92.48,9.02 180 top
R34  95.96,5.08 270 top
R35  5.26,46.59 90 top
R36  21.8,28.24 180 top
R37  19.9,21.05 180 top
R38  21.81,25.1 0 top
R39  8.96,34.21 90 top
R40  8.86,27.01 270 top
R41  75,72 0 top
R42  58.4,71.6 180 top
R43  5.26,40.1 90 top
R44  5.28,32.66 90 top
R45  5.24,23.08 90 top
R46  5.26,15.02 90 top
T1  127.03,46.7 270 top
U1  20.81,40.25 180 top
U$1  5,57 0 top
U$2  145,20 0 top
X1  145.08,62.45 90 top
X2  145.19,41.49 90 top

### Tracks (layer width: path | path; a pad name or v marks a point on that pad's centre or on a via)
BATT+  (via drill 0.51)
  Top 0.254: R36.2 R38.1 20.86,21.07 R37.1 23.21,21.05 v23.24,21.08
  Top 0.406: 101.6,7.14 95.86,7.11 95.86,6.13 R34.1 | 101.6,7.14 105.05,7.16 P11.P$1 | Q11.P$4 101.6,7.14
  Bottom 0.254: 39.78,20.12 103.07,20.12 107.9,6.4 P11.P$1
  Bottom 0.305: v23.24,21.08 33.66,21.08 34.62,20.12 39.78,20.12
GND  (via drill 0.51, 0.6)
  Top 0.254: 114.3,46.99 114.3,49.84 C18.2 | 114.3,44.45 114.3,43.66 C17.2 | 59.44,71.78 R42.1 59.44,71.55 59.31,71.48 | 59.44,73.38 C19.2 59.44,73.61 | 42.98,70.64 P12.P$1 | C13.2 11.24,47.64 v11.24,49.02 | C16.2 12.68,26.06 R40.2 8.86,20.14 8.2,19.48 3.98,19.48 J4.2 | U1.30 18.4,43.5 19.33,44.42 | 19.33,44.42 19.46,44.55 | 19.43,44.32 19.33,44.42 | U1.30 14.29,43.5 v13.95,43.51 | U1.31 U1.30
  Top 0.406: 59.44,73.38 59.44,71.78 | 42.98,70.64 52.37,70.64 56.69,74.95 58.29,74.95 59.44,73.61 | R41.1 72.21,72 72,71.79 59.54,71.79 R42.1 | C2.2 v11.24,49.02 | C15.2 12.87,25.87 C16.2
  Top 0.61: C18.2 114.3,49.89 114.3,46.99 | 114.3,44.45 114.3,46.99 | 114.3,46.99 v112.06,46.99 | 19.46,44.55 19.46,44.04 21.72,41.78 21.72,30.73 21.71,30.74 C14.2
  Top 0.813: v19.49,54.97 19.46,48.46 19.46,44.55
  Bottom 0.406: J5.2 0.6,13.46 0.58,21.42 | 0.58,21.42 0.54,31.08 | 0.54,31.08 0.56,38.46 | 0.56,38.46 0.54,45 | 0.54,45 0.54,48.9 0.57,48.93 11.28,48.93 v11.24,49.02 | J1.2 0.54,45 | J2.2 0.56,38.46 | J3.2 0.54,31.08 | J4.2 0.58,21.42
  Bottom 0.61: v112.06,46.99 112.06,66.5 109.27,69.85 99.06,69.85 77.52,69.9 75.64,71.78 45.82,71.88 44.14,71.88 P12.P$1 42.64,70.58
  Bottom 0.813: 42.64,70.58 38.1,66.04 38.1,60.96 34.29,57.15 21.59,57.15 v19.49,54.97 13.36,48.92 11.28,48.93
LTC-C0  (via drill 0.51)
  Top 0.254: 57.61,71.78 57.61,73.38 C19.1 | 57.61,71.78 R42.2 | U1.26 18.16,45.52 18.16,55.88 20.55,59.13 | 57.61,71.78 58.17,70.46 v69.6,70.46 | v86.92,65.13 C1.2
  Top 0.305: 20.55,59.13 34.95,59.13 37.41,61.59 37.41,66.02 38.73,67.18 51.82,67.18 56.26,71.63 R42.2
  Bottom 0.254: v69.6,70.46 71.68,68.48 83.26,68.48 v86.92,65.13
LTC-C1  (via drill 0.51)
  Top 0.254: v58.52,62.87 58.52,61.27 C3.2 | v83.53,66.06 90.98,66.06 91.21,66.29 92.81,66.29 93.95,65.15 | 93.95,65.15 94.87,66.06 96.93,66.06 R2.2 | 93.95,65.15 C1.1 | U1.24 25.31,46.01 35.69,56.39
  Top 0.305: C3.2 46.23,61.21 45.34,63.12 43.43,64.14 42.42,64.14 40.64,63.12 40.13,62.36 40.13,60.83 35.69,56.39
  Bottom 0.254: v58.52,62.87 76.58,62.87 79.78,66.06 v83.53,66.06
LTC-C2  (via drill 0.51)
  Top 0.254: R7.2 62.64,61.27 60.35,61.27 C3.1 60.12,61.27 59.99,61.27 | C4.2 91.44,52.35 90.32,52.4 82.44,60.53 82,60.98 82,68 80.78,69.22 80.78,69.24 | v44.6,56.69 39.73,56.69 36.68,54.05 27.62,45 U1.22 | v50.39,63.35 52.22,64.57 59.79,64.57 60.2,64.16 | 59.99,61.27 59.69,60.96 | 59.99,61.27 60.2,61.47 60.2,64.16 | 60.2,64.16 v61.01,64.97 | v61.42,69.24 80.78,69.24 | 80.78,69.24
  Bottom 0.254: v44.6,56.69 v50.39,63.35 | v61.01,64.97 61.42,65.38 v61.42,69.24
LTC-C3
  Top 0.254: 52.78,56.24 57.15,54.41 57.15,50.06 C5.2 | 52.78,56.24 52.78,58.06 53.01,58.29 69.41,58.29 71.15,56.55 85,56.57 90.75,50.98 92.35,50.98 93.5,52.12 | 93.5,52.12 94.18,51.44 96.01,51.44 R10.2 | 93.5,52.12 C4.1 | 52.78,56.24 48.01,56.24 45.52,53.65 40.89,53.65 31.25,44.01 U1.20
LTC-C4  (via drill 0.51)
  Top 0.254: R13.2 61.95,50.06 59.21,50.06 C5.1 v59.13,52.22 | C6.2 91.67,36.35 80.24,36.35 76.65,36.36 76,37 75,38 75,43 74.41,43.59 71,43.59 68.64,45.95 v61.98,45.92 | U1.18 33.64,42.99 v41.81,51.16
  Bottom 0.254: v61.98,45.92 60.81,47.09 60.6,47.4 60.6,51.1 v59.13,52.22 58.06,51.16 v41.81,51.16
LTC-C5  (via drill 0.51)
  Top 0.254: 58.06,35.43 C7.2 | R16.2 96.24,36.35 93.73,36.35 C6.1 93.5,36.12 93.29,35.1 83.64,35.07 82.55,35.62 75.1,35.62 75.01,35.53 75.01,30.44 58.1,30.48 58.09,35.46 57.97,35.46 C7.2 | v54.61,43.18 53.75,43.79 40.46,43.81 38.05,43.81 36.23,42 U1.16 | v54.61,35.56 C7.2
  Bottom 0.254: v54.61,43.18 v54.61,35.56
LTC-C6  (via drill 0.51)
  Top 0.254: v81.89,24.23 91.21,24.23 C8.2 | v62.61,33.15 62.64,34.75 R19.2 62.41,34.98 61.95,35.43 59.89,35.43 C7.1 59.69,35.56 59.69,34.04 v60.45,33.43 | v53.29,41 52.12,41.81 40.64,41.83 39.12,41.83 38.32,41.01 U1.14
  Bottom 0.254: v81.89,24.23 73.15,24.23 v62.61,33.15 | v60.45,33.43 54.86,33.43 53.29,35.26 v53.29,41
LTC-C7
  Top 0.254: R22.2 96.01,24.23 93.27,24.23 C8.1 93.04,24 91.9,22.86 75.72,22.86 75.72,26.76 75.65,29.4 75.37,29.5 54.98,29.52 52.65,27.18 | C9.2 57.15,17.6 55.02,17.58 52.68,19.96 52.65,27.18 | 52.65,27.18 46.81,33.02 32.89,33.02 31.42,34.49 31.42,37.74 29.17,39.99 U1.12
LTC-C8  (via drill 0.51)
  Top 0.254: C9.1 59.26,18.97 55.75,22.48 53.72,22.48 53.34,22.86 53.34,26.3 54.6,27.55 | C10.2 90.26,14.21 88.75,15.72 75.18,15.72 | 75.18,15.72 63.19,15.72 R25.2 | 54.6,27.55 55.63,28.59 74.12,28.6 74.93,27.79 74.93,15.98 75.18,15.72 | U1.10 27.95,39 29.82,37.13 29.82,32.82 32.23,30.4 v43.26,30.4 | v55.45,26.57 55.45,26.7 54.6,27.55
  Bottom 0.254: v43.26,30.4 51.61,30.4 v55.45,26.57
LTC-C9  (via drill 0.51)
  Top 0.254: 79.08,9.3 78,9.3 | 78,9.3 74.92,9.3 | 74.92,9.3 74.93,9.33 74.93,3.39 58.25,3.41 C11.2 55.84,7.62 v54.61,7.62 | R28.2 96.01,13.03 95,11.66 81.74,11.66 79.1,9.32 78,9.3 | C10.1 93.27,14.17 93.26,13.93 93.26,13.7 92.35,13.03 89.61,13.03 87.63,14.91 74.91,14.91 74.9,11.1 74.92,9.3 | v45.72,13.97 30.18,13.97 28.3,15.85 28.3,36.65 26.96,37.98 U1.8
  Bottom 0.254: v54.61,7.62 48.26,13.97 v45.72,13.97
LTC-C10  (via drill 0.51)
  Top 0.254: v81.44,4.34 90.75,4.34 C12.2 | v65.61,4.34 64.69,4.34 64.24,4.8 R31.2 64.01,5.03 60.35,5.03 C11.1 60.1,6.71 57.25,8.74 45.52,8.79 44.2,7.67 28.83,7.67 26.92,9.58 26.92,36.22 26.15,36.99 U1.6
  Bottom 0.254: v65.61,4.34 v81.44,4.34
LTC-C11
  Top 0.254: R34.2 95.78,4.34 93.04,4.34 C12.1 92.87,3 92.38,2.52 27.28,2.52 25.81,3.99 25.81,35.84 25.64,36 U1.4
LTC-S1
  Top 0.254: 19.79,60.68 19.77,60.7 17.02,57.87 U1.25 | 50.89,75.91 50.93,75.95
  Top 0.305: 19.79,60.68 35.36,60.68 36.63,61.95 36.63,67.7 44.84,75.91 50.89,75.91 | 50.93,75.95 63.63,75.95 89.59,75.92 90.55,75.92 91.9,74.57 91.9,69.54 R1.2
LTC-S2  (via drill 0.51)
  Top 0.254: v57.15,66.04 57.15,68.12 R6.2 | U1.23 26.58,45.5 36.45,55.37
  Top 0.305: 36.45,55.37 v39.62,58.42
  Bottom 0.305: v57.15,66.04 52.07,66.04 48.13,63.75 46.23,62.61 46.23,60.45 44.58,58.42 v39.62,58.42
LTC-S3  (via drill 0.51)
  Top 0.254: R9.2 91.06,56.44 89.66,56.44 v89.15,55.98 | v44.81,55.02 39.67,55.02 29.15,44.49 U1.21
  Bottom 0.254: v89.15,55.98 45.97,55.98 v44.81,55.02
LTC-S4  (via drill 0.51)
  Top 0.254: R12.2 56.34,55.88 v58.57,54.66 | v46.23,52.38 41.45,52.38 32.58,43.5 U1.19
  Bottom 0.254: v58.57,54.66 58.62,53.8 57.86,53.14 47.04,53.19 v46.23,52.38
LTC-S5  (via drill 0.51)
  Top 0.254: R15.2 v87.43,44.81 | v47.7,44.86 40.41,44.88 37.34,44.88 34.96,42.51 U1.17
  Bottom 0.254: v87.43,44.81 v47.7,44.86
LTC-S6
  Top 0.254: R18.2 56.54,40.69 55.78,41.05 52.32,42.98 40.51,42.95 38.71,42.95 37.25,41.49 U1.15
LTC-S7  (via drill 0.51)
  Top 0.254: 92.13,30.4 R21.2 v88.62,30.25 | U1.13 51.1,40.49 52.78,39.32 54.56,38.05 v60.5,38.1
  Bottom 0.254: v88.62,30.25 88.59,38.05 | 88.59,38.05 88.47,38.08 | v60.5,38.1 88.59,38.05
LTC-S8  (via drill 0.51)
  Top 0.254: 39.37,31.75 39.6,31.75 | 39.6,31.75 45.72,31.75 v50.8,26.67 | v55.27,23.67 55.3,23.64 R24.2 | U1.11 28.61,39.48 30.73,37.36 30.73,33.4 32.41,31.73 39.57,31.73 39.6,31.75
  Bottom 0.254: v50.8,26.67 53.8,23.67 v55.27,23.67
LTC-S9  (via drill 0.51)
  Top 0.254: v88.52,21.13 90.25,19.4 R27.2 | U1.9 27.39,38.49 29.06,36.83 29.06,27.89 30.25,26.7 44.42,26.7 v44.45,26.67
  Bottom 0.254: v44.45,26.67 49.89,21.23 88.44,21.23 88.52,21.16 v88.52,21.13
LTC-S10
  Top 0.254: R30.2 58.29,11.89 50.52,11.89 49.28,12.65 29.11,12.65 27.56,14.2 27.56,36.47 26.53,37.5 U1.7
LTC-S11  (via drill 0.51)
  Top 0.254: R33.2 v88.71,9.03 | 24.33,36.47 U1.5 25.87,36.49 26.34,36.02 26.42,8.53 26.4,8.53 28.34,6.5 v38.81,6.5
  Bottom 0.254: v88.71,9.03 86.67,6.5 v38.81,6.5
N$1
  Top 0.254: 59.44,68.35 R6.1
  Top 0.406: 59.44,68.35 60.07,68.35 63.35,65.08 64.81,65.08 Q2.P$3
N$2
  Top 0.406: R1.1 96.34,69.52 97.03,70.21 100.33,70.21 Q1.P$3
N$3
  Top 0.254: 42.98,61.04 P2.P$1 | R8.1 71.63,59.21
  Top 0.406: 67.21,59.21 66.75,59.21 66.88,59.18 44.93,59.18 42.98,61.04 | Q2.P$4 67.24,62.59 | 67.24,62.59 67.24,61.07 67.21,59.21 | R7.1 66.78,63.05 67.24,62.59 | 71.63,59.21 67.21,59.21
N$4  (via drill 0.51)
  Top 0.254: 96.93,68.35 R2.1 97.16,68.12 | 107.9,66.98 P1.P$1
  Top 0.406: 102.87,68.12 106.76,68.12 107.9,66.98 | 102.87,68.12 97.16,68.12 | Q1.P$4 102.87,70.12 102.87,68.12 | R3.1 v79.98,64.44
  Bottom 0.254: 107.9,66.75 P1.P$1
  Bottom 0.406: v79.98,64.44 82.73,64.44 83.95,63.93 105.44,63.93 107.9,66.75
N$5  (via drill 0.51)
  Top 0.406: R41.2 v86,72 | v95,72 100.13,72 Q1.P$1 | Q1.P$5 Q1.P$6 Q1.P$1 | Q1.P$2 Q1.P$1
  Bottom 0.406: v86,72 v95,72
N$6
  Top 0.406: Q2.P$2 Q2.P$1 Q2.P$6 Q2.P$5 R3.2
N$7
  Top 0.406: R9.1 98.38,56.47 99.06,57.15 99.06,58.62 Q3.P$3
N$8
  Top 0.254: 96.01,53.26 R10.1 96.24,53.26 | 107.9,53.95 P3.P$1
  Top 0.406: 97.74,52.32 97.74,50.72 96.95,49.89 90.55,49.89 87.44,52.99 R11.1 | 96.24,53.26 97.74,52.32 | 101.6,53.95 99.21,53.95 97.74,52.32 | 101.6,53.95 107.9,53.95 | Q3.P$4 101.53,54.02 101.6,53.95
N$9  (via drill 0.51)
  Top 0.406: 77.95,58.98 78,58.98 | 78,58.98 v80.97,58.95 | Q3.P$5 Q3.P$6 Q3.P$1 Q3.P$2 96.67,59.69 v95.94,58.95 | R8.2 78,58.98
  Bottom 0.406: v80.97,58.95 v95.94,58.95
N$10
  Top 0.254: 58.29,57.15 R12.1
  Top 0.406: 58.29,57.15 59.54,57.15 63.7,52.98 64.93,52.98 Q4.P$3
N$11
  Top 0.406: 67.36,47.32 47.65,47.32 P4.P$1 | Q4.P$4 67.34,52.07 | 67.34,52.07 67.36,47.32 | R13.1 67.34,52.07 | R14.2 67.68,47 67.36,47.32
N$12
  Top 0.406: Q4.P$2 Q4.P$1 Q4.P$6 Q4.P$5 71.42,54 R11.2
N$13
  Top 0.254: 93.73,41.38 93.73,40.92 R15.1
  Top 0.406: R15.1 93.57,41.4 96.88,44.7 99.11,44.7 Q5.P$3
N$14
  Top 0.254: 96.01,38.86 96.24,38.63 R16.1 | 107.9,41.38 P5.P$1
  Top 0.406: 96.01,38.86 96.01,38.89 | 96.01,38.89 96.01,41.38 101.6,41.38 | 96.01,38.89 91,38.89 | 91,38.89 90.93,38.89 | 101.6,41.38 107.9,41.38 | Q5.P$4 101.53,41.45 101.6,41.38 | R17.2 89.89,40 91,38.89
N$15
  Top 0.406: R14.1 98.85,47 Q5.P$1 | Q5.P$1 Q5.P$2 | Q5.P$1 Q5.P$6 Q5.P$5
N$16
  Top 0.406: R18.1 61.05,40.7 62.23,39.52 64.82,39.52 Q6.P$3
N$17
  Top 0.254: 62.41,36.8 R19.1 | 42.98,35.66 P6.P$1
  Top 0.406: 62.41,36.8 44.12,36.8 42.98,35.66 | Q6.P$4 67.29,36.63 | 67.29,36.63 67.29,34.72 69.01,33 R20.2 | R19.1 67.29,36.63
N$18
  Top 0.406: Q6.P$6 Q6.P$5 | Q6.P$6 Q6.P$1 Q6.P$2 | R17.1 70.24,40 68.68,41.56 67.32,41.56 Q6.P$6
N$19
  Top 0.254: 94.18,30.18 R21.1
  Top 0.406: R21.1 97.4,30.24 97.89,30.73 99.11,30.73 Q7.P$3
N$20
  Top 0.254: R22.1 96.01,26.29 96.11,26.31
  Top 0.406: 96.11,26.31 96.12,27.23 101.6,27.23 | P7.P$1 104.7,27.23 101.6,27.23 | Q7.P$4 101.53,27.3 101.6,27.23 | R23.2 96.07,26 R22.1
N$21
  Top 0.406: Q7.P$5 Q7.P$6 Q7.P$1 Q7.P$2 97.79,31.75 96.54,33 R20.1
N$22
  Top 0.254: 59.21,23.55 R24.1
  Top 0.406: 59.21,23.55 62.82,23.55 Q8.P$3
N$23
  Top 0.254: 62.18,19.2 62.18,18.52 R25.1 | 42.98,22.86 P8.P$1
  Top 0.406: 62.18,19.2 66.04,19.2 | 42.98,22.86 49.81,15.67 60.33,15.67 60.86,18.44 R25.1 | Q8.P$4 65.97,19.27 66.04,19.2 | R26.1 66.24,19 66.04,19.2
N$24
  Top 0.406: Q8.P$6 Q8.P$5 | Q8.P$6 Q8.P$1 Q8.P$2 | R23.1 66.27,26 Q8.P$6
N$25
  Top 0.254: 93.73,19.43 R27.1
  Top 0.406: Q9.P$3 R27.1
N$26
  Top 0.406: 99.52,15.11 R28.1 94.97,15.09 94.44,12.32 89.61,12.32 88.07,12.96 87.94,13 80,13 79,12 R29.1 | 99.52,15.11 107.28,15.11 P9.P$1 | Q9.P$4 99.52,15.11
N$27
  Top 0.406: 81.84,22.15 82,22.15 | 82,22.15 94.64,22.15 95.42,21.37 Q9.P$1 Q9.P$2 Q9.P$5 Q9.P$6 | R26.2 78.85,19 82,22.15
N$28
  Top 0.254: 60.35,11.89 R30.1
  Top 0.406: R30.1 63.17,11.76 63.5,11.43 66.08,11.43 Q10.P$3
N$29
  Top 0.254: 63.55,7.54 64.01,7.09 R31.1 64.24,6.86 64.5,6.6 | 42.98,10.29 P10.P$1
  Top 0.406: 63.55,7.54 63.55,10.29 | 42.98,10.29 63.55,10.29 | 63.55,10.29 67.4,10.29 Q10.P$4 | R32.1 72.16,6.48 64.61,6.48 64.5,6.6
N$30
  Top 0.406: Q10.P$6 | Q10.P$6 Q10.P$1 Q10.P$2 | Q10.P$6 Q10.P$5 | R29.2 71.2,12 69.86,13.34 68.56,13.34 Q10.P$6
N$31
  Top 0.254: R33.1 96.92,9.02 97.96,10.06 Q11.P$3
N$32
  Top 0.254: R37.2
  Top 0.406: Q12.4 Q12.2 18.24,18.9 18.95,19.61 R37.2 | R37.2 C16.1
N$33
  Top 0.406: Q11.P$5 Q11.P$6 Q11.P$1 Q11.P$2 97.2,11.04 96.68,10.52 84.3,10.52 80.08,6.3 R32.2
N$34  (via drill 0.51)
  Top 0.254: R5.2 127.33,56.92 126.64,56.24 126.42,56.24 122.76,52.58 122.76,51.21 T1.1 119.32,51.15 v119.28,51.1 | U1.48 12.89,34.48 12.7,34.29 v12.7,29.4 | v101.6,17.78 102.87,17.78 119.38,34.29 v119.38,39.37
  Bottom 0.254: v12.7,29.4 12.7,17.78 13.97,16.51 99.06,16.51 v101.6,17.78 | v119.38,39.37 119.28,39.47 v119.28,51.1
N$35  (via drill 0.51)
  Top 0.254: 123.62,49.1 123.22,48.69 122.76,48.69 T1.3 | 123.62,49.1 127.33,52.81 127.33,55.09 R5.1 | U1.47 11.82,34.99 11.33,34.49 11.33,32.16 v9.06,31.19 | v15.24,3.81 17.78,1.27 111.1,1.27 113.59,3.76 113.59,15.84 130.89,33.14 130.89,39.29 130.81,39.37 130.72,39.45 125.73,44.45 125.73,46.99 123.62,49.1
  Bottom 0.254: v9.06,31.19 8.84,8.08 13.06,3.86 15.19,3.86 v15.24,3.81
N$36  (via drill 0.51)
  Top 0.254: U1.40 17.01,38.48 | U1.37 15.91,39.99 15.75,39.83 15.75,38.63 | 15.75,38.63 15.9,38.48 17.01,38.48 | 17.01,38.48 18.21,38.48 18.34,38.35 18.34,31.9 18.34,31.42 19,30.76 C14.1 | U1.36 14.46,40.5 v13.97,40.13 | v13.97,38.84 14.48,38.48 15.6,38.48 15.75,38.63
  Top 0.406: Q12.3 15.93,18.72 v15.98,18.77 | v16.03,31.95 18.29,31.95 18.34,31.9
  Bottom 0.254: v13.97,40.13 v13.97,38.84
  Bottom 0.406: v15.98,18.77 15.98,31.9 v16.03,31.95
N$37  (via drill 0.51)
  Top 0.254: U1.35 12.55,41.01 12.2,40.66 v12.18,39.76 | v9.16,45.72 9.16,46.27 C13.1
  Bottom 0.254: v12.18,39.76 9.29,39.77 v9.16,45.72
N$38  (via drill 0.51)
  Top 0.254: R44.1 5.3,31.6 5.36,31.7 | U1.34 11.99,41.49 10.74,41.5 v10.38,41.6 | v7.68,45.62 7,46.3
  Top 0.406: C2.1 7.47,46.77 7,46.3 6.32,45.62 5.3,45.62 R35.1 v5.26,43.82 | v5.26,37.62 R43.1 | R44.1 v5.28,30.16 | R45.1 5.26,22.11 v5.26,20.46 | R46.1 5.28,14.05 v5.28,12.46
  Bottom 0.254: v10.38,41.6 10.4,46.02 10.4,46.78 8.82,46.76 v7.68,45.62
  Bottom 0.406: v5.26,43.82 5.28,43.24 v5.26,37.62 5.26,30.18 v5.28,30.16 5.28,20.48 v5.26,20.46 5.26,12.48 v5.28,12.46
N$39  (via drill 0.51)
  Top 0.254: T1.6 122.76,44.58 123.44,44.58 128.02,40.01 128.02,37.72 R4.2 128.25,37.49 129.39,36.35 v129.39,34.29 | U1.42 12.86,37.5 12.26,36.74 v10.13,36.74 v10.12,36.73
  Bottom 0.254: v10.12,36.73 10.01,9.3 13.41,5.28 39.55,5.26 105.84,5.26 106.98,4.12 109.04,4.12 112.52,6.53 112.52,17.42 v129.39,34.29
N$40  (via drill 0.51)
  Top 0.254: T1.8 122.76,42.06 122.76,40.92 122.78,40.89 122.78,40.28 127.18,35.89 128.02,35.89 R4.1 128.09,34.05 112.27,18.23 v112.27,4.32 | U1.41 11.77,37.98 v11.62,37.84 | v11.62,11.24 8.18,11.24 v7.6,10.66
  Bottom 0.254: v112.27,4.32 110.49,2.54 12.09,2.54 7.62,7.62 7.6,7.64 v7.6,10.66 | v11.62,37.84 v11.62,11.24
N$41
  Top 0.254: U1.45 10.9,36 10.06,35.16 R39.2
N$42
  Top 0.254: U1.46 11.28,35.5 10.12,34.34 10.12,33.36 10.02,33.26 R39.1 8,33.26 7.76,33.02 7.76,29.94 8.86,28.84 R40.1
N$43  (via drill 0.51)
  Top 0.254: U1.1 24.59,25.56 24.16,25.12 22.79,25.12 | 22.79,25.12 R38.2 | 22.79,25.12 22.79,23.31 v22.81,23.29 | v19.46,23.29 19.46,25.45 19,25.91 17.88,25.91 C15.1
  Bottom 0.254: v22.81,23.29 v19.46,23.29
N$44
  Top 0.254: C18.1 116.13,49.84 122.53,49.84 T1.2
N$45
  Top 0.254: C17.1 116.13,43.66 122.53,43.66 T1.7
N$46
  Top 0.254: U1.2 23.66,34.99 23.52,34.85 23.52,29.01 R36.1
N$47  (via drill 0.51)
  Top 0.254: U1.38 18.86,39.48 19.1,39.24 19.1,33.35 v19.74,32.72 | v20.55,18.87 Q12.1
  Bottom 0.254: v19.74,32.72 19.74,31.77 17.83,29.87 17.83,19.89 18.85,18.87 v20.55,18.87
N$48
  Top 0.254: T1.16 134.15,51.15 136,53 136,66 137,67 141.54,67 X1.1
N$49
  Top 0.254: T1.14 133.61,48.61 137,52 137,64 138,65 140.75,65 X1.2
N$50
  Top 0.254: T1.11 136.8,44.8 138,46 141.7,46 X2.1
N$51
  Top 0.254: T1.9 137.26,42.26 139,44 140.85,44 X2.2
N$52
  Top 0.254: J2.1 R43.2 5.28,41.07 5.26,42.38 7.58,44.49 7.59,44.5 11.23,44.5 12.19,45.47 14.73,45.47 15.71,44.49 U1.28
N$54  (via drill 0.51)
  Top 0.254: v12.71,47.54 12.7,46.18 12.7,46.05 14.86,46.05 15.91,45 U1.27 | R35.2 J1.1
  Bottom 0.254: J1.1 10.66,47.55 v12.71,47.54
N$56
  Top 0.254: J3.1 R44.2 5.3,33.63 5.3,34.6 6.42,35.72 6.42,42.5 7.94,44.02 11.48,44.02 12.34,44.88 14.55,44.88 15.43,44.01 U1.29
N$57
  Top 0.254: J4.1 R45.2 7.02,25.81 7.02,42.2 7.82,43 12,43 12.49,42.51 U1.32
N$58  (via drill 0.51)
  Top 0.254: J5.1 R46.2 v7.44,15.98 | U1.33 12.22,42 12.08,42 11.58,42.5 8.4,42.5 v8.18,41.96
  Bottom 0.254: v7.44,15.98 7.44,16.76 8.16,17.48 8.16,41.94 v8.18,41.96

### Text on the board
tPlace: BATT- | C1 | OUT | IN | BATT+
tNames: eGolf BMS Mk2 | Rev 1.a